# EAGLE design wirelessrgbled (EAGLE 6.1)
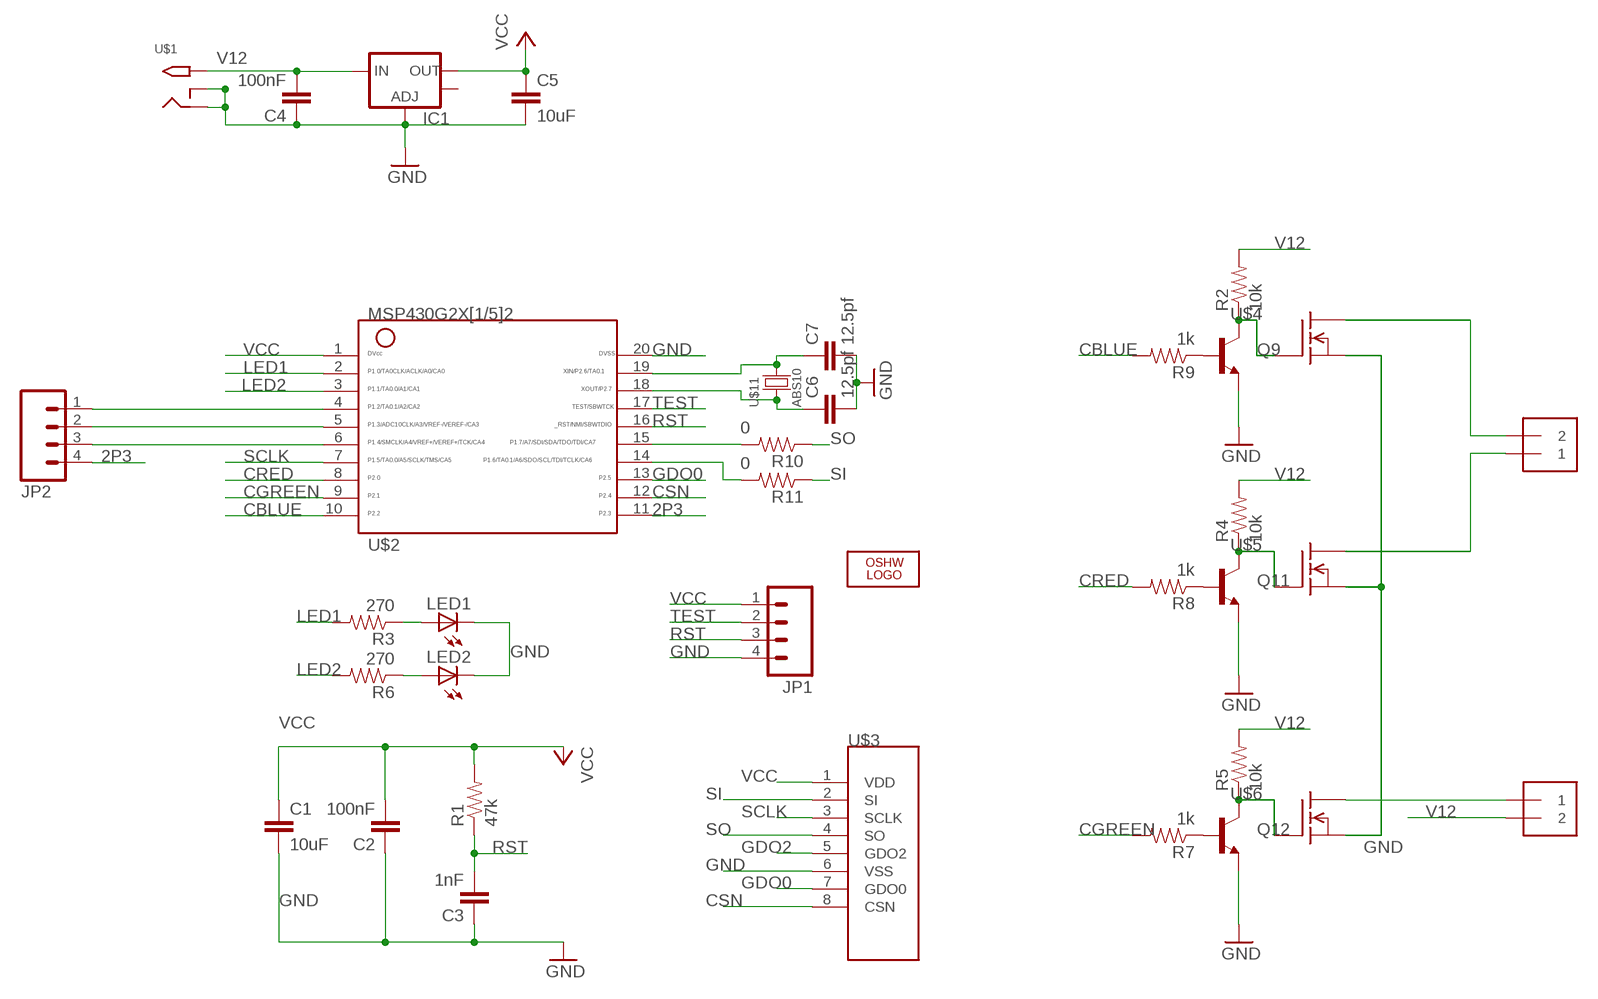
[diagram p0: schematic, sheet 1]

## Parts
C1  10uF  CAP0805  [0805]
C2  100nF  CAP0805  [0805]
C3  1nF  CAP0805  [0805]
C4  100nF  CAP0805  [0805]
C5  10uF  CAP0805  [0805]
C6  12.5pf  CAP0805  [0805]
C7  12.5pf  CAP0805  [0805]
IC1  V_REG_LM1117SOT223  [SOT223]
J1  1X2-3.5MM  [1X2-3.5MM]
J2  1X2-3.5MM  [1X2-3.5MM]
JP1  M04PTH  [1X04]
JP2  M04PTH  [1X04]
LED1  LEDCHIPLED_0805  [CHIPLED_0805]
LED2  LEDCHIPLED_0805  [CHIPLED_0805]
LOGO1  OSHW_LOGO_10MILX0200-NT  [OSHW_10X200_NOTEXT]
Q9  TRANSISTOR_NPNSOT23  [SOT23]
Q11  TRANSISTOR_NPNSOT23  [SOT23]
Q12  TRANSISTOR_NPNSOT23  [SOT23]
R1  47k  RESISTOR0805-RES  [0805]
R2  10k  RESISTOR0805-RES  [0805]
R3  270  RESISTOR0805-RES  [0805]
R4  10k  RESISTOR0805-RES  [0805]
R5  10k  RESISTOR0805-RES  [0805]
R6  270  RESISTOR0805-RES  [0805]
R7  1k  RESISTOR0805-RES  [0805]
R8  1k  RESISTOR0805-RES  [0805]
R9  1k  RESISTOR0805-RES  [0805]
R10  0  RESISTOR0805-RES  [0805]
R11  0  RESISTOR0805-RES  [0805]
U$1  2.1MMJACKTHM  [PJ-102A]
U$2  G2X[1/5]2---PW20  [PW20]
U$3  CC2500-MODULE  [CC2500-MODULE]
U$4  BUK92150  [TO252]
U$5  BUK92150  [TO252]
U$6  BUK92150  [TO252]
U$11  ABS10  [ABS10]

## Nets
2P3: JP2.4 U$2.11
CBLUE: R9.2 U$2.10
CGREEN: R7.2 U$2.9
CRED: R8.2 U$2.8
CSN: U$2.12 U$3.8(CSN)
GDO0: U$2.13 U$3.7(GDO0)
GDO2: U$3.5(GDO2)
GND: C1.2 C2.1 C3.1 C4.1 C5.2 C6.2 C7.2 IC1.1(ADJ) JP1.4 LED1.C LED2.C Q9.2(E) Q11.2(E) Q12.2(E) U$1.RING U$1.RING_SW U$2.20 U$3.6(VSS) U$4.3(S) U$5.3(S) U$6.3(S)
LED1: R3.2 U$2.2
LED2: R6.2 U$2.3
N$1: JP2.2 U$2.5
N$2: Q9.3(C) R2.1 U$4.1(G)
N$3: LED1.A R3.1
N$4: J2.1 U$6.2(D)
N$5: J1.2 U$4.2(D)
N$6: J1.1 U$5.2(D)
N$7: R10.2 U$2.15
N$8: LED2.A R6.1
N$9: R11.2 U$2.14
N$11: Q11.3(C) R4.1 U$5.1(G)
N$12: Q9.1(B) R9.1
N$13: Q11.1(B) R8.1
N$14: Q12.1(B) R7.1
N$15: Q12.3(C) R5.1 U$6.1(G)
N$16: JP2.1 U$2.4
N$17: JP2.3 U$2.6
N$21: C7.1 U$2.19 U$11.P$2
N$22: C6.1 U$2.18 U$11.P$1
RST: C3.2 JP1.3 R1.1 U$2.16
SCLK: U$2.7 U$3.3(SCLK)
SI: R11.1 U$3.2(SI)
SO: R10.1 U$3.4(SO)
TEST: JP1.2 U$2.17
V12: C4.2 IC1.3(IN) J2.2 R2.2 R4.2 R5.2 U$1.TIP
VCC: C1.1 C2.2 C5.1 IC1.2(OUT) JP1.1 R1.2 U$2.1 U$3.1(VDD)
Unconnected: IC1.4(OUT)

## Library data of the parts
C1-C7 = SparkFun:CAP: Capacitor Standard 0603 ceramic capacitor, and 0.1" leaded capacitor.
IC1 = SparkFun:V_REG_LM1117: Voltage Regulator LM1117 Standard adjustable voltage regulator but in SMD form. Spark Fun Electronics SKU : COM-00595
J1 J2 = adafruit:1X2: 3.5mm Terminal block http://www.ladyada.net/library/pcb/eaglelibrary.html
JP1 JP2 = SparkFun:M04: Header 4 Standard 4-pin 0.1" header. Use with straight break away headers (SKU : PRT-00116), right angle break away headers (PRT-00553), swiss pins (PRT-00743), machine pins (PRT-00117), and female headers (PRT-00115). Molex polarized connector foot print use with SKU : PRT-08231 with associated crimp pins and housings. 1MM SMD Version SKU: PRT-10208
LED1 LED2 = adafruit:LED: LED OSRAM: - CHIPLED LG R971, LG N971, LY N971, LG Q971, LY Q971, LO R971, LY R971 LH N974, LH R974 LS Q976, LO Q976, LY Q976 LO Q996 - Hyper CHIPLED LW Q18S LB Q993, LB Q99A, LB R99A - SideLED LS A670, LO A670, LY A670, LG A670, LP A670 LB A673, LV A673, LT A673, LW A673 LH A674 LY A675 LS A676, LA A676, LO A676, LY A676, LW A676 LS A679, LY A679, LG A679 - Hyper Micro SIDELED® LS Y876, LA Y876, LO Y876, LY Y876 LT Y87S - SmartLED LW L88C, LW L88S LB L89C, LB L89S, LG L890 LS L89K, LO L89K, LY L89K LS L896, LA L896, LO L896, LY L896 - TOPLED LS T670, LO T670, LY T670, LG T670, LP T670 LSG T670, LSP T670, LSY T670, LOP T670, LYG T670 LG T671, LOG T671, LSG T671 LB T673, LV T673, LT T673, LW T673 LH T674 LS T676, LA T676, LO T676, LY T676, LB T676, LH T676, LSB T676, LW T676 LB T67C, LV T67C, LT T67C, LS T67K, LO T67K, LY T67K, LW E67C LS E67B, LA E67B, LO E67B, LY E67B, LB E67C, LV E67C, LT E67C LW T67C LS T679, LY T679, LG T679 LS T770, LO T770, LY T770, LG T770, LP T770 LB T773, LV T773, LT T773, LW T773 LH T774 LS E675, LA E675, LY E675, LS T675 LS T776, LA T776, LO T776, LY T776, LB T776 LHGB T686 LT T68C, LB T68C - Hyper Mini TOPLED® LB M676 - Mini TOPLED Santana® LG M470 LS M47K, LO M47K, LY M47K Source: http://www.osram.convergy.de/
LOGO1 = ohw-logo:OSHW_LOGO_10MIL
Q9 Q11 Q12 = SparkFun:TRANSISTOR_NPN: Transistor NPN BJT configuration in SOT23 package. MMBT2222 is the common NPN we use. Double check BCE configuration again layout.
R1-R11 = SparkFun:RESISTOR: Resistor Basic schematic elements and footprints for 0603, 1206, and PTH resistors.
U$1 = adafruit:2.1MMJACK: 2.1mm x 5.5mm THM DC jack with internal switch. Digikey part #PJ-102A, 4UCON part #05537 2.1mm x 5.5mm SMT DC jack with internal switch. Digikey part #PJ-002A-SMT, 4UCON part #03267 By microbuilder.eu & adafruit.com
U$2 = TI_MSP430_v16:G2X[1/5]2---PW20: MSP430G2X[1/5]2 MSP430G2x52, MSP430G2x12 TSSOP (PW) 20 Pin Package http://focus.ti.com/docs/prod/folders/print/msp430g2452.html
U$3 = alvaro:CC2500-MODULE
U$4-U$6 = alvaro:BUK92150
U$11 = alvaro:ABS10: ABS10 SMD Low Profile Crystal

## Board
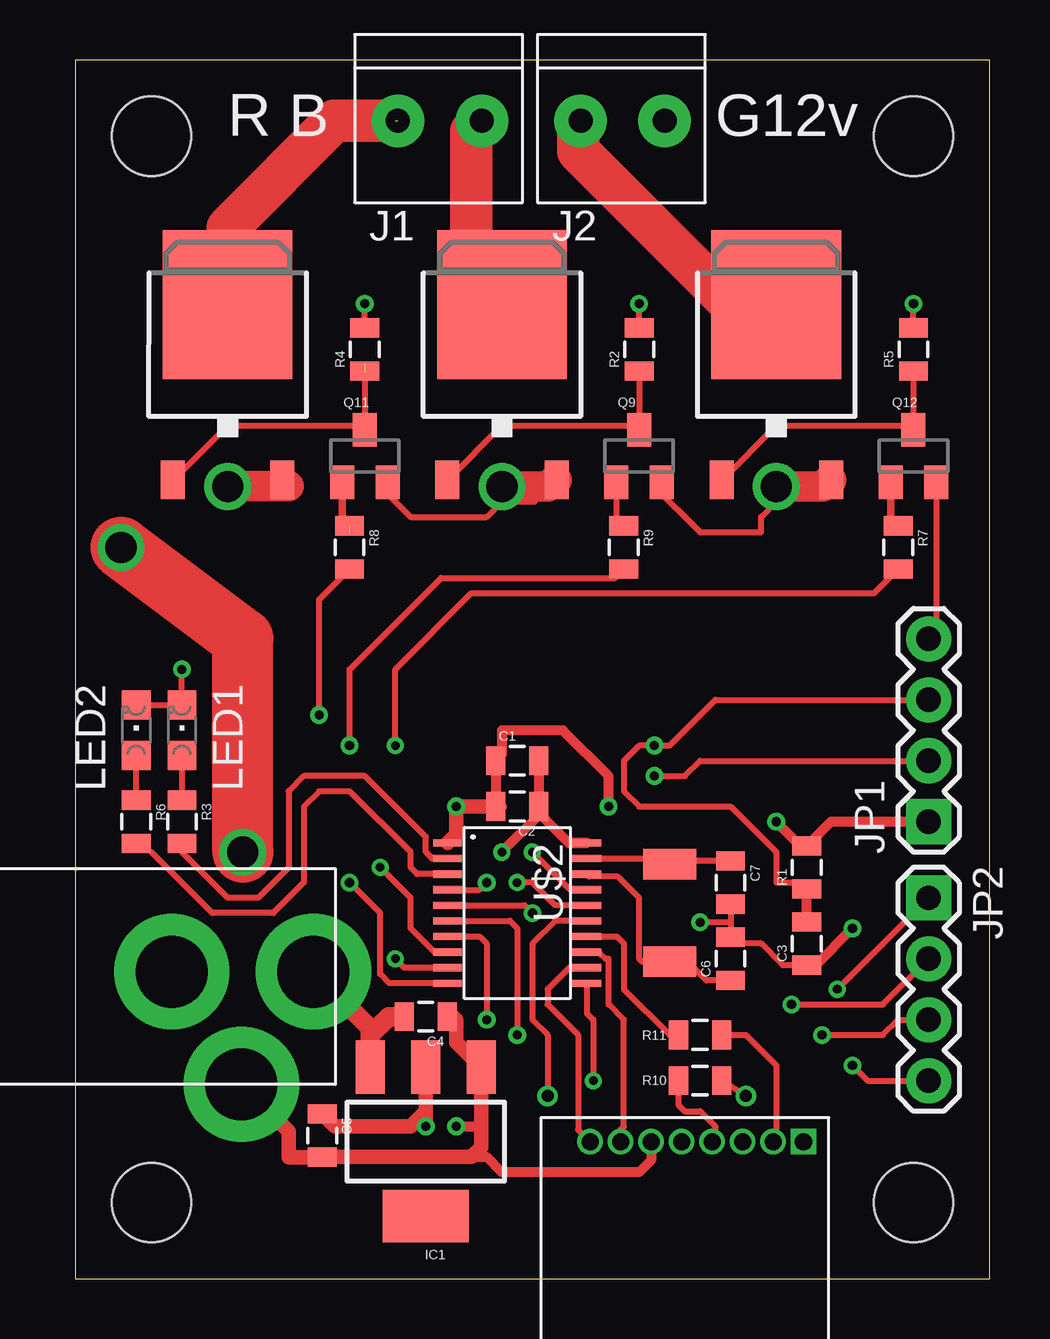
[diagram p1: board, top side]
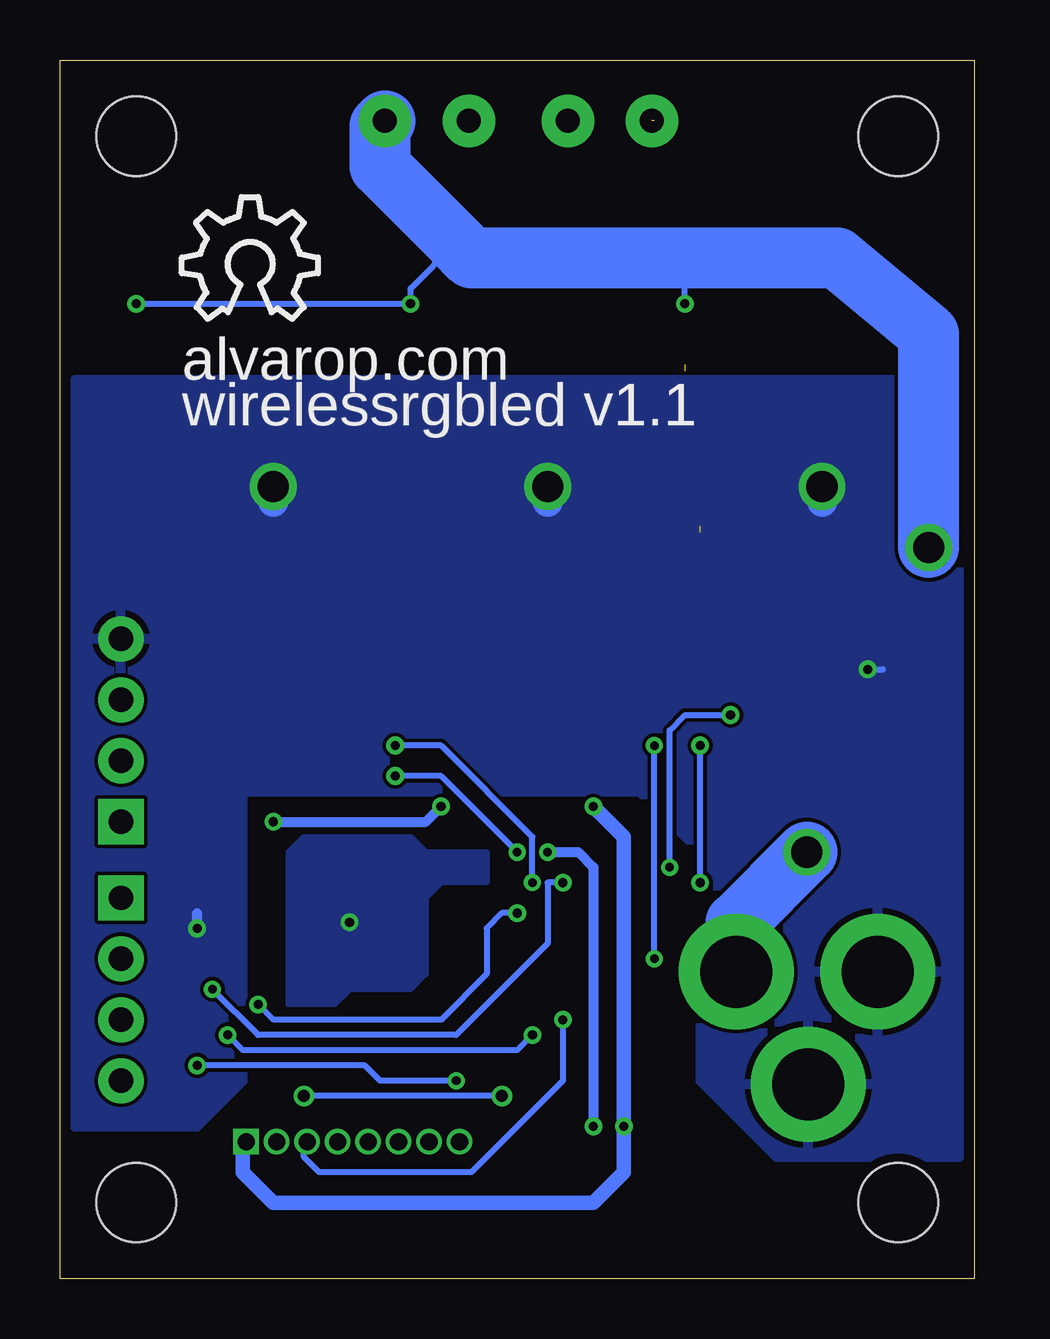
[diagram p2: board, bottom side, seen from below]

Size 38.1 x 50.8 mm. Coordinates in mm from the lower left corner, seen from the top.
Outline: 0,50.8 0,0 38.1,0 38.1,50.8 0,50.8
Copper layers (1*16): Top 0.0356mm / dielectric 1.5011mm / Bottom 0.0356mm
Design rules: minimum track width 6mil, minimum drill 13mil, track to track 6mil, track to pad 6mil, pad to pad 6mil, via to via 6mil, smd to smd 6mil, copper to edge 15mil, drill to drill 6mil, minimum pad ring 7mil, minimum via ring 7mil, stop-mask expansion 4mil, vias tented up to drill 0mil, thermal gap 10mil

### Footprints (pad centres in the part's own frame; a part is rotated, then mirrored left to right if it is on the bottom)
0805 = smd 0.8 x 1.2: 1 -0.9,0; 2 0.9,0
SOT223 = smd 1.219 x 2.235: 1 -2.311,-3.099; 2 0,-3.099; 3 2.311,-3.099 | smd 3.6 x 2.2: 4 0,3.099
1X2-3.5MM = drill 1 pad 2.184: 1 1.8,0; 2 -1.7,0
1X04 = drill 1.016 pad 1.88 square: 1 0,0 | drill 1.016 pad 1.88: 2 2.54,0; 3 5.08,0; 4 7.62,0
CHIPLED_0805 = smd 1.2 x 1.2: A 0,-1.05; C 0,1.05
SOT23 = smd 1 x 1.4: 1 -0.95,-1.1; 2 0.95,-1.1; 3 0,1.1
PJ-102A = drill 3 pad 4.8: RING 0.1,-3.39; RING_SW -4.6,-6.29; TIP 0.1,-9.29
PW20 = smd 0.3 x 1.2: 1 -2.925,-2.9; 2 -2.275,-2.9; 3 -1.625,-2.9; 4 -0.975,-2.9; 5 -0.325,-2.9; 6 0.325,-2.9; 7 0.975,-2.9; 8 1.625,-2.9; 9 2.275,-2.9; 10 2.925,-2.9; 11 2.925,2.9; 12 2.275,2.9; 13 1.625,2.9; 14 0.975,2.9; 15 0.325,2.9; 16 -0.325,2.9; 17 -0.975,2.9; 18 -1.625,2.9; 19 -2.275,2.9; 20 -2.925,2.9
CC2500-MODULE = drill 0.711 pad 1.016 square: 1 -4.945,0 | drill 0.711 pad 1.016: 2 -3.675,0; 3 -2.405,0; 4 -1.135,0; 5 0.135,0; 6 1.405,0; 7 2.675,0; 8 3.945,0
TO252 = smd 1 x 1.6: 1 -2.28,-4.8; 3 2.28,-4.8 | smd 5.4 x 6.2: 2 0,2.5
STAND-OFF = hole 3.302: 0,0
ABS10 = smd 1.27 x 2.21: P$1 -2.032,0; P$2 2.032,0

### Placement (x,y rotation side)
C1  18.41,21.59 0 top
C2  18.41,19.68 180 top
C3  30.48,13.97 90 top
C4  14.61,10.92 180 top
C5  10.29,5.97 270 top
C6  27.3,13.34 90 top
C7  27.3,16.51 270 top
IC1  14.61,5.71 180 top
J1  15.24,48.26 180 top
J2  22.86,48.26 180 top
JP1  35.56,19.05 90 top
JP2  35.56,15.88 270 top
LED1  4.45,22.86 0 top
LED2  2.54,22.86 0 top
LOGO1  33.02,40.01 0 bottom
Q9  23.5,34.29 0 top
Q11  12.06,34.29 0 top
Q12  34.92,34.29 0 top
R1  30.48,17.14 90 top
R2  23.5,38.73 90 top
R3  4.45,19.05 270 top
R4  12.06,38.73 90 top
R5  34.92,38.73 90 top
R6  2.54,19.05 270 top
R7  34.29,30.48 270 top
R8  11.43,30.48 270 top
R9  22.86,30.48 270 top
R10  26.04,8.26 0 top
R11  26.04,10.16 180 top
U$1  0.64,12.7 90 top
U$2  18.41,15.24 270 top
U$3  25.4,5.71 180 top
U$4  17.78,38.1 0 top
U$5  6.35,38.1 0 top
U$6  29.21,38.1 0 top
U$7  [STAND-OFF]  3.17,47.62 0 top
U$8  [STAND-OFF]  3.17,3.17 0 top
U$9  [STAND-OFF]  34.92,3.17 0 top
U$10  [STAND-OFF]  34.92,47.62 0 top
U$11  24.77,15.24 90 top

### Tracks (layer width: path | path; a pad name or v marks a point on that pad's centre or on a via)
2P3  (via drill 0.36, 0.38)
  Top 0.254: U$2.11 21.32,11.07 21.59,10.79 v21.59,8.26 | v32.38,8.89 33.02,8.26 JP2.4
  Bottom 0.254: v21.59,8.26 24.77,8.26 25.4,8.89 v32.38,8.89
CBLUE  (via drill 0.38)
  Top 0.254: U$2.10 13.09,12.31 12.7,12.7 12.7,15.24 v11.43,16.51 | v11.43,22.23 11.43,25.4 15.24,29.21 22.49,29.21 R9.2
  Bottom 0.254: v11.43,16.51 v11.43,22.23
CGREEN  (via drill 0.36)
  Top 0.254: U$2.9 13.71,12.96 v13.34,13.34 | v13.34,22.23 13.34,25.4 16.51,28.57 33.28,28.57 R7.2
  Bottom 0.254: v13.34,13.34 v13.34,22.23
CRED  (via drill 0.36, 0.38)
  Top 0.254: U$2.8 14.96,13.62 13.97,14.61 13.97,15.88 v12.7,17.14 | v10.16,23.5 10.16,28.31 R8.2
  Bottom 0.254: v12.7,17.14 12.7,22.86 12.06,23.5 v10.16,23.5
CSN
  Top 0.254: U$2.12 20.59,12.96 19.68,12.06 19.68,11.43 20.95,10.16 20.95,6.21 U$3.8
GDO0
  Top 0.254: U$3.7 22.73,6.21 22.86,6.35 22.86,10.79 22.23,11.43 22.23,13.34 22.1,13.34 21.84,13.59 21.34,13.59 U$2.13
GND  (via drill 0.36, 0.38, 1.3)
  Top 0.254: v26.04,14.86 27.3,14.86 C7.2 C6.2 27.57,13.97 28.57,13.97 29.48,13.07 C3.1 | C2.1 19.32,19.42 | U$2.20 | 31.75,33.04 U$6.3 | 8.89,33.04 U$5.3 | LED2.C LED1.C v4.45,25.4 | Q11.2 13.02,32.7 13.97,31.75 17.14,31.75 17.78,32.38 19.14,32.38 U$4.3 | Q9.2 24.3,33.19 24.13,33.02 26.04,31.11 28.57,31.11 28.57,31.75 29.21,32.38 v29.21,33.02 | Q12.2 35.88,26.98 JP1.4
  Top 0.406: C2.1 C1.2 19.32,19.32 v17.78,17.78 | 20.57,18.16 U$2.20 | v15.88,6.35 16.92,6.35 | C3.1 30.85,13.07 v32.38,14.61 | U$2.20 20.57,18.16 | 20.57,18.16 19.32,19.42 | U$3.6 24,4.95 23.5,4.45 17.78,4.45 17.14,5.08 16.51,5.08
  Top 0.61: U$1.RING_SW 8.89,6.13 8.89,5.08 8.9,5.07 C5.2 16.51,5.08 16.92,5.49 16.92,6.35 IC1.1 15.88,9.86 15.88,10.79 15.75,10.92 C4.1
  Top 1.27: 8.89,33.04 6.37,33.04 v6.35,33.02 | U$4.3 19.96,33.3 19.68,33.02 v17.78,33.02 | U$6.3 31.39,33.3 31.11,33.02 v29.21,33.02
  Bottom 0.254: v4.45,25.4 3.81,25.4
  Bottom 0.406: v17.78,17.78 16.51,17.78 15.88,17.14 v15.88,6.35 | v32.38,14.61 32.38,15.24
  Bottom 1.27: v6.35,33.02 6.35,32.38 | v17.78,33.02 17.78,32.38 | v29.21,33.02 29.21,32.38
  pour Bottom: 20.32,17.78 20.32,16.51 22.23,16.51 22.86,15.88 22.86,13.34 22.86,12.7 23.5,12.06 26.04,12.06 26.67,11.43 28.57,11.43 28.57,17.78 27.94,18.41 23.5,18.41 22.86,17.78
  pour Bottom: 8.26,5.08 0.64,5.08 0.64,37.47 37.47,37.47 37.47,6.35 32.38,6.35 30.48,8.26 30.48,20.32 13.97,20.32 11.43,17.78 11.43,8.26
LED1
  Top 0.254: U$2.2 14.87,17.52 14.61,17.78 14.61,18.41 12.06,20.95 9.53,20.95 8.89,20.32 8.89,17.14 7.62,15.88 6.35,15.88 4.45,17.78 R3.2
LED2
  Top 0.254: U$2.3 14.25,16.86 13.97,17.14 13.97,17.78 11.43,20.32 10.16,20.32 9.53,19.68 9.53,16.51 8.26,15.24 5.71,15.24 3.17,17.78 R6.2
N$1  (via drill 0.38)
  Top 0.254: U$2.5 18.73,15.56 v19.05,15.24 | v29.84,11.43 33.66,11.43 JP2.2
  Bottom 0.254: v19.05,15.24 19.68,15.24 20.32,14.61 20.32,12.7 22.23,10.79 29.21,10.79 v29.84,11.43
N$2
  Top 0.254: R2.1 Q9.3 23.32,35.56 17.78,35.56 15.52,33.3 U$4.1
N$3
  Top 0.254: LED1.A R3.1
N$4
  Top 1.778: U$6.2 27.34,40.6 20.95,46.99 20.95,48.16 J2.1
N$5
  Top 1.27: U$4.2 17.78,40.64
  Top 1.778: 17.78,40.64 16.51,41.91 16.51,47.83 J1.2
N$6  (1 unrouted)
  Top 1.778: U$5.2 6.35,43.81 10.79,48.26 13.34,48.26
N$7  (via drill 0.5, 0.5 pad 0.25)
  Top 0.254: U$2.15 20,14.91 19.05,13.97 19.05,10.79 19.68,10.16 v19.68,7.62 | v27.94,7.62 R10.2
  Bottom 0.254: v19.68,7.62 v27.94,7.62
N$8
  Top 0.254: R6.1 LED2.A
N$9
  Top 0.254: U$2.14 22.57,14.27 22.86,13.97 22.86,12.06 24.77,10.16 R11.2
N$11  (1 unrouted)
  Top 0.254: 12.06,38.1 Q11.3 11.89,35.56 6.35,35.56 4.09,33.3 U$5.1
N$12
  Top 0.254: Q9.1 22.55,31.7 R9.1
N$13  (1 unrouted)
  Top 0.254: 11.12,31.43 11.43,31.11
  Top 0.305: Q11.1 11.12,31.43
N$14
  Top 0.254: 33.98,31.7 R7.1
  Top 0.305: Q12.1 33.98,31.7
N$15
  Top 0.254: R5.1 Q12.3 34.76,35.56 29.21,35.56 26.95,33.3 U$6.1
N$16  (via drill 0.36, 0.38)
  Top 0.254: U$2.4 16.85,16.21 v17.14,16.51 | v31.75,12.06 JP2.1
  Bottom 0.254: v17.14,16.51 17.78,16.51 17.78,13.97 21.59,10.16 29.84,10.16 v31.75,12.06
N$17  (via drill 0.38)
  Top 0.254: U$2.6 18.11,14.91 18.41,14.61 v18.41,10.16 | v31.11,10.16 33.66,10.16 34.29,10.79 JP2.3
  Bottom 0.254: v18.41,10.16 19.05,9.53 30.48,9.53 v31.11,10.16
N$21
  Top 0.254: U$2.19 24.52,17.52 U$11.P$2 24.9,17.41 C7.1
N$22
  Top 0.254: C6.1 26.3,12.44 25.4,13.34 24.89,13.34 U$11.P$1 23.62,13.21 23.5,13.34 23.5,15.88 22.61,16.76 21.42,16.76 U$2.18
RST  (via drill 0.36, 0.38)
  Top 0.254: U$2.16 20,15.56 19.05,16.51 v18.41,16.51 | JP1.3 26.67,24.13 24.77,22.23 v24.13,22.23 23.5,22.23 22.86,21.59 22.86,20.32 23.5,19.68 27.3,19.68 29.21,17.78 29.21,16.51 30.21,16.51 R1.1
  Top 0.406: C3.2 R1.1
  Bottom 0.254: v18.41,16.51 18.41,18.41 22.23,22.23 v24.13,22.23
SCLK  (via drill 0.38)
  Top 0.254: U$2.7 16.85,14.27 17.14,13.97 v17.14,10.79
  Bottom 0.254: v17.14,10.79 17.14,8.26 20.95,4.45 27.3,4.45 27.94,5.08 27.94,5.71 U$3.3
SI
  Top 0.254: R11.1 27.94,10.16 29.21,8.89 29.21,5.85 U$3.2
SO
  Top 0.254: R10.1 25.14,7.25 25.4,6.99 26.04,6.99 26.67,6.35 26.67,5.85 U$3.4
TEST  (via drill 0.36, 0.38)
  Top 0.254: U$2.17 20.61,16.21 v19.05,17.78 | v24.13,20.95 25.4,20.95 26.04,21.59 JP1.2
  Bottom 0.254: v19.05,17.78 22.23,20.95 v24.13,20.95
V12  (via drill 0.38, 1.3)
  Top 0.254: R4.2 v12.06,40.64 | R2.2 v23.5,40.64 | 34.92,39.37 R5.2 v34.92,40.64
  Top 0.813: IC1.3 12.29,10.16 | 12.29,10.16 12.29,10.43 U$1.TIP | C4.2 13.06,10.92 12.29,10.16
  Top 2.54: v6.99,17.78 6.99,26.67 v1.91,30.48
  Bottom 0.254: v12.06,40.64 12.06,42.55 | 21.59,43.18 23.5,41.27 v23.5,40.64 v34.92,40.64
  Bottom 2.54: U$1.TIP 9.93,14.84 v6.99,17.78 | v1.91,30.48 1.91,39.37 5.71,42.55 12.06,42.55 20.95,42.55 21.59,43.18 24.77,46.35 24.77,48.05 J2.2
VCC  (via drill 0.38)
  Top 0.406: 17.78,19.68 17.52,19.95 C1.1 17.78,21.86 17.78,22.86 20.32,22.86 22.23,20.95 v22.23,19.68 | JP1.1 31.48,19.05 R1.2 30.21,18.05 v29.21,19.05
  Top 0.61: 14.61,6.99 13.97,6.35 10.81,6.35 C5.1 | 14.61,6.99 IC1.2 v14.61,6.35 14.61,6.99 | U$2.1 15.88,18.52 v15.88,19.68 C2.2 17.52,19.95
  Bottom 0.406: v29.21,19.05 22.86,19.05 v22.23,19.68
  Bottom 0.61: U$3.1 30.48,5.58 30.48,4.45 29.21,3.17 15.88,3.17 14.61,4.45 v14.61,6.35 14.61,18.41 v15.88,19.68

### Text on the board
tNames: R | B | G | 12v
bNames: alvarop.com | wirelessrgbled v1.1